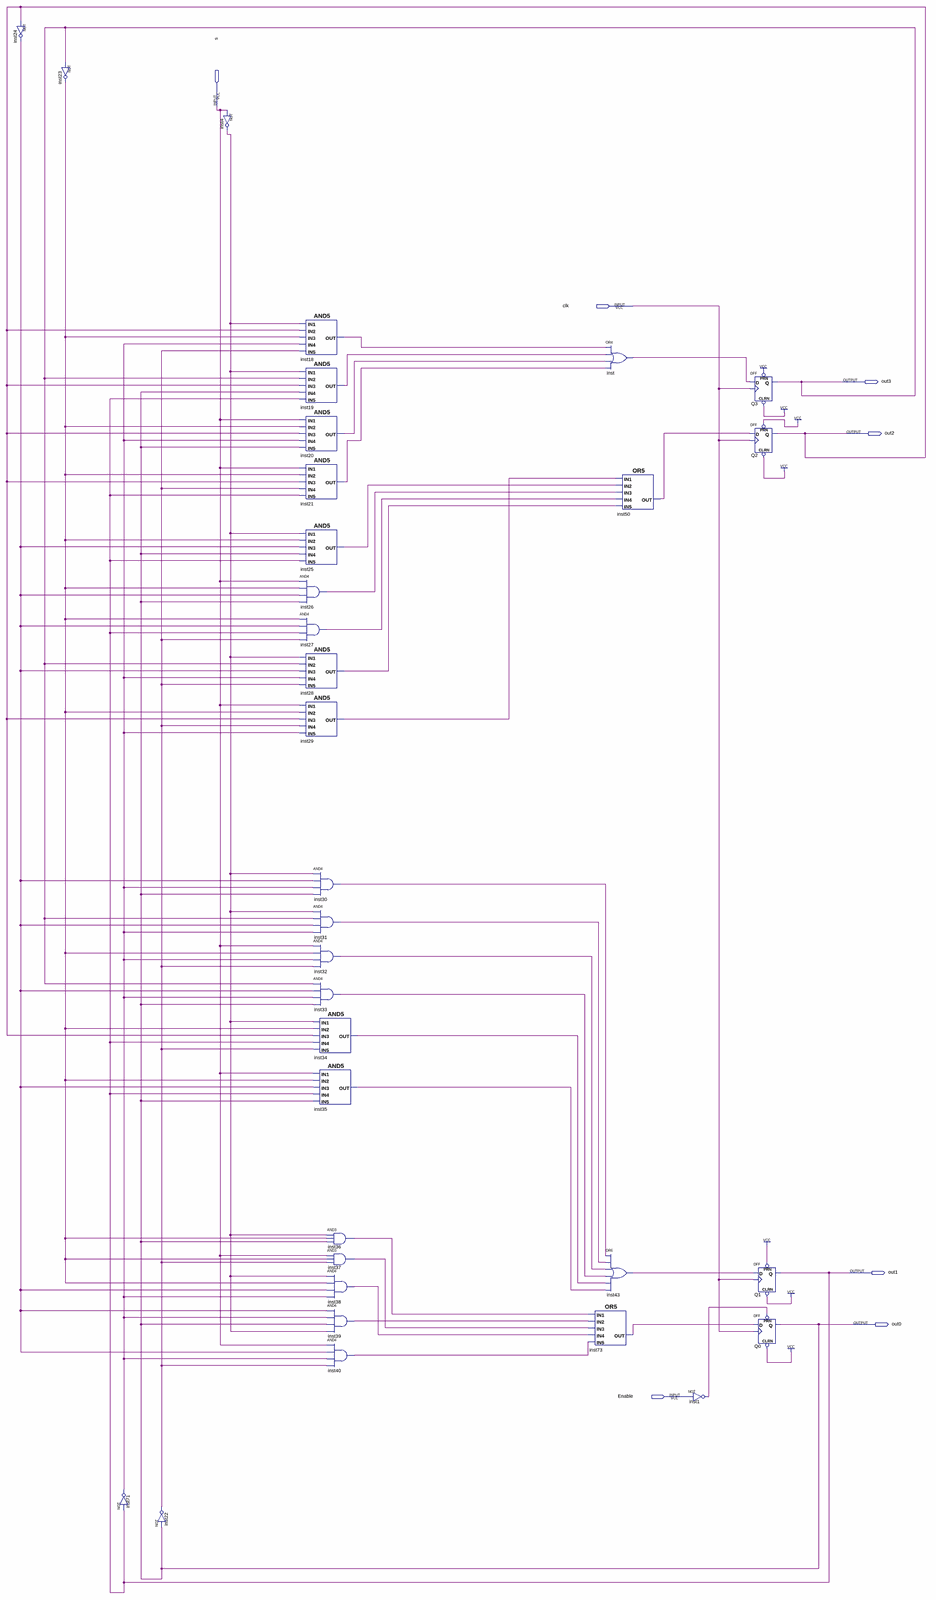
[diagram p0: schematic sheet, whole]
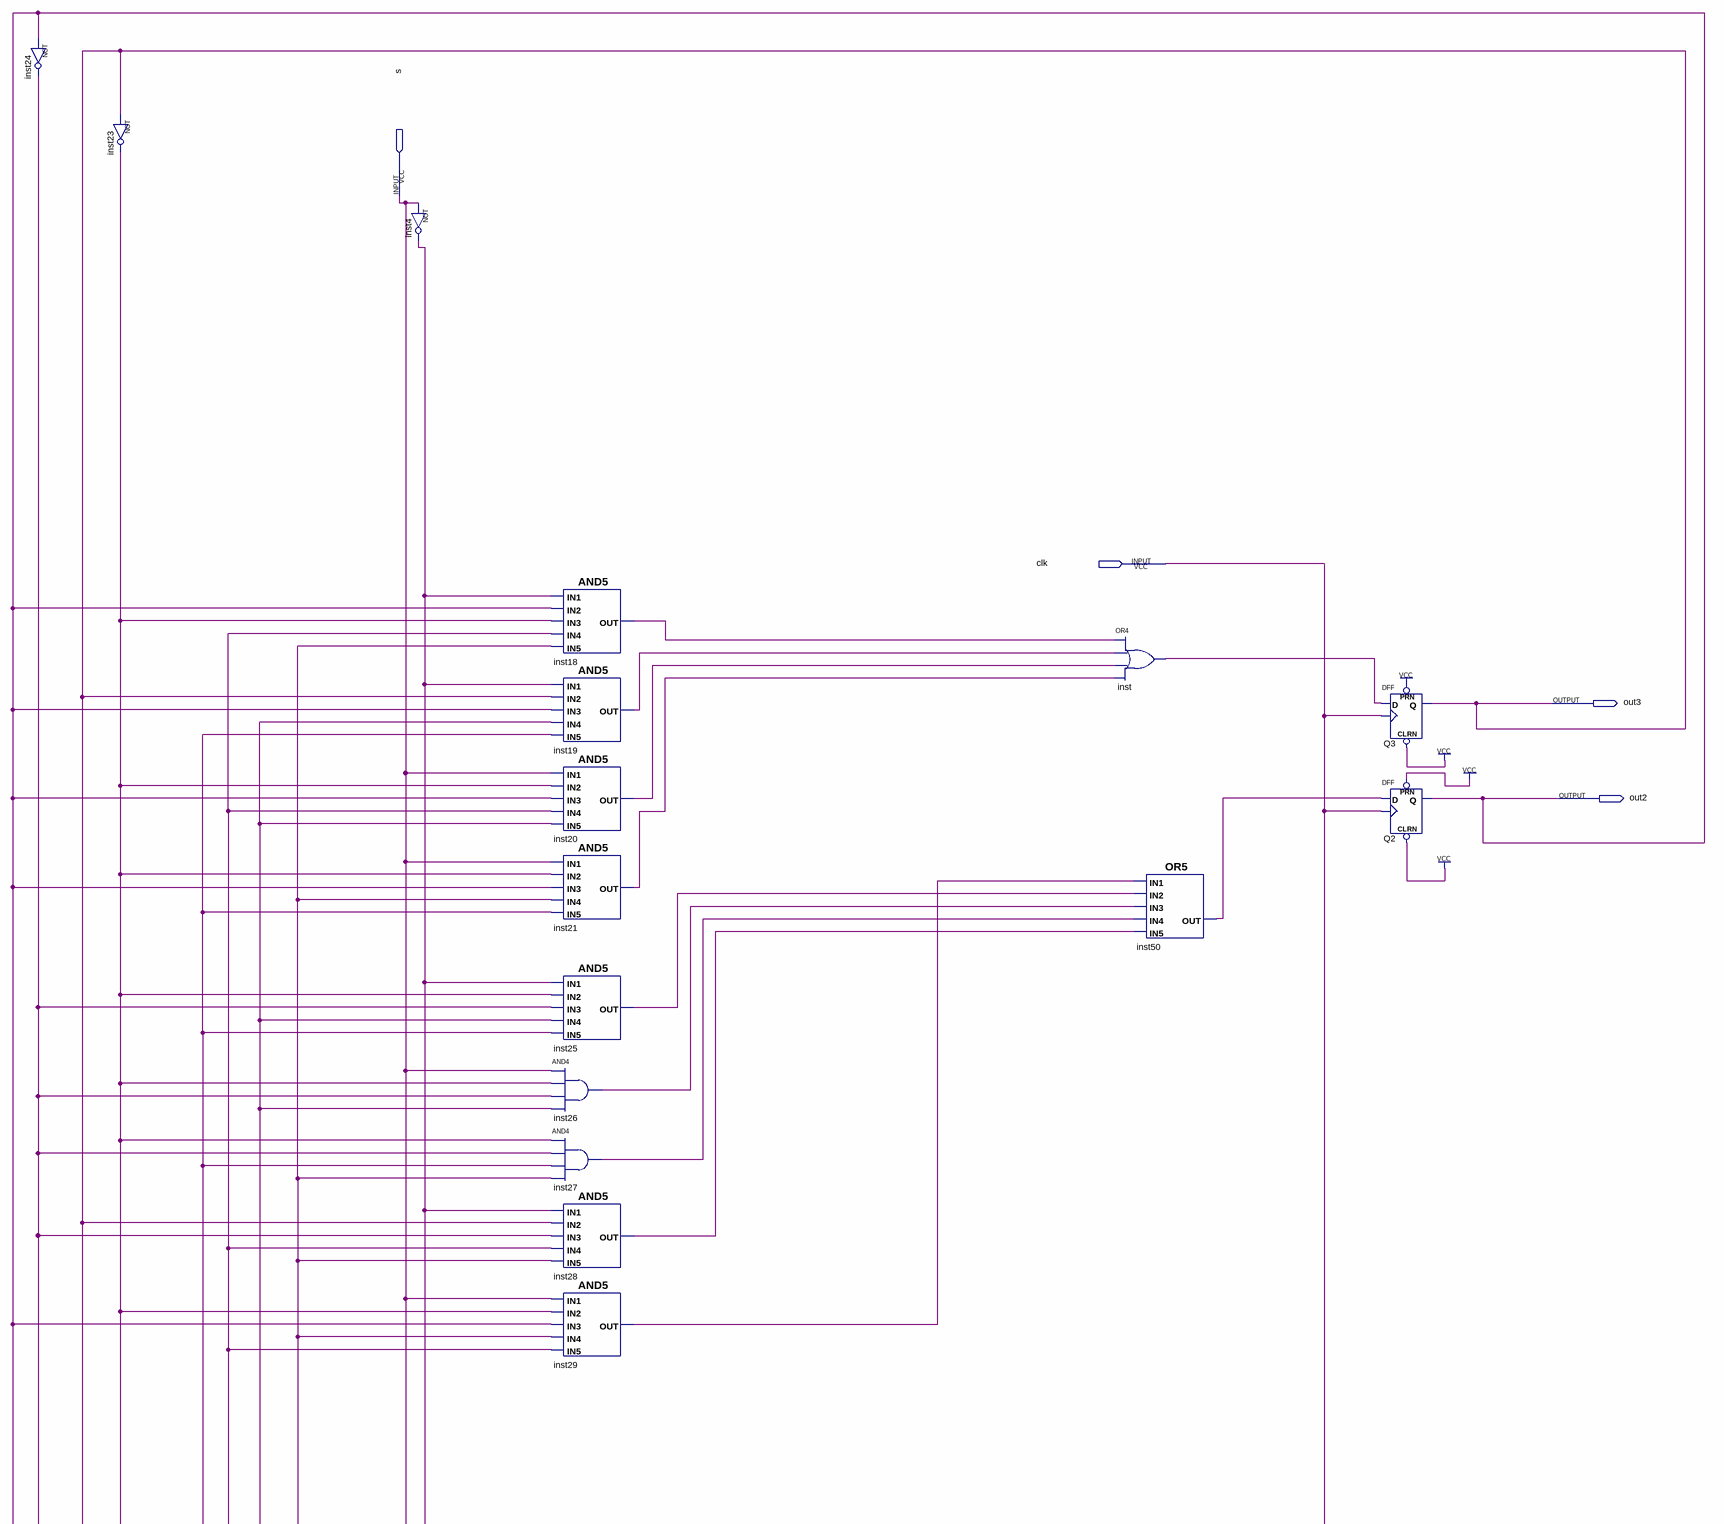
[diagram p1: schematic sheet, upper part]
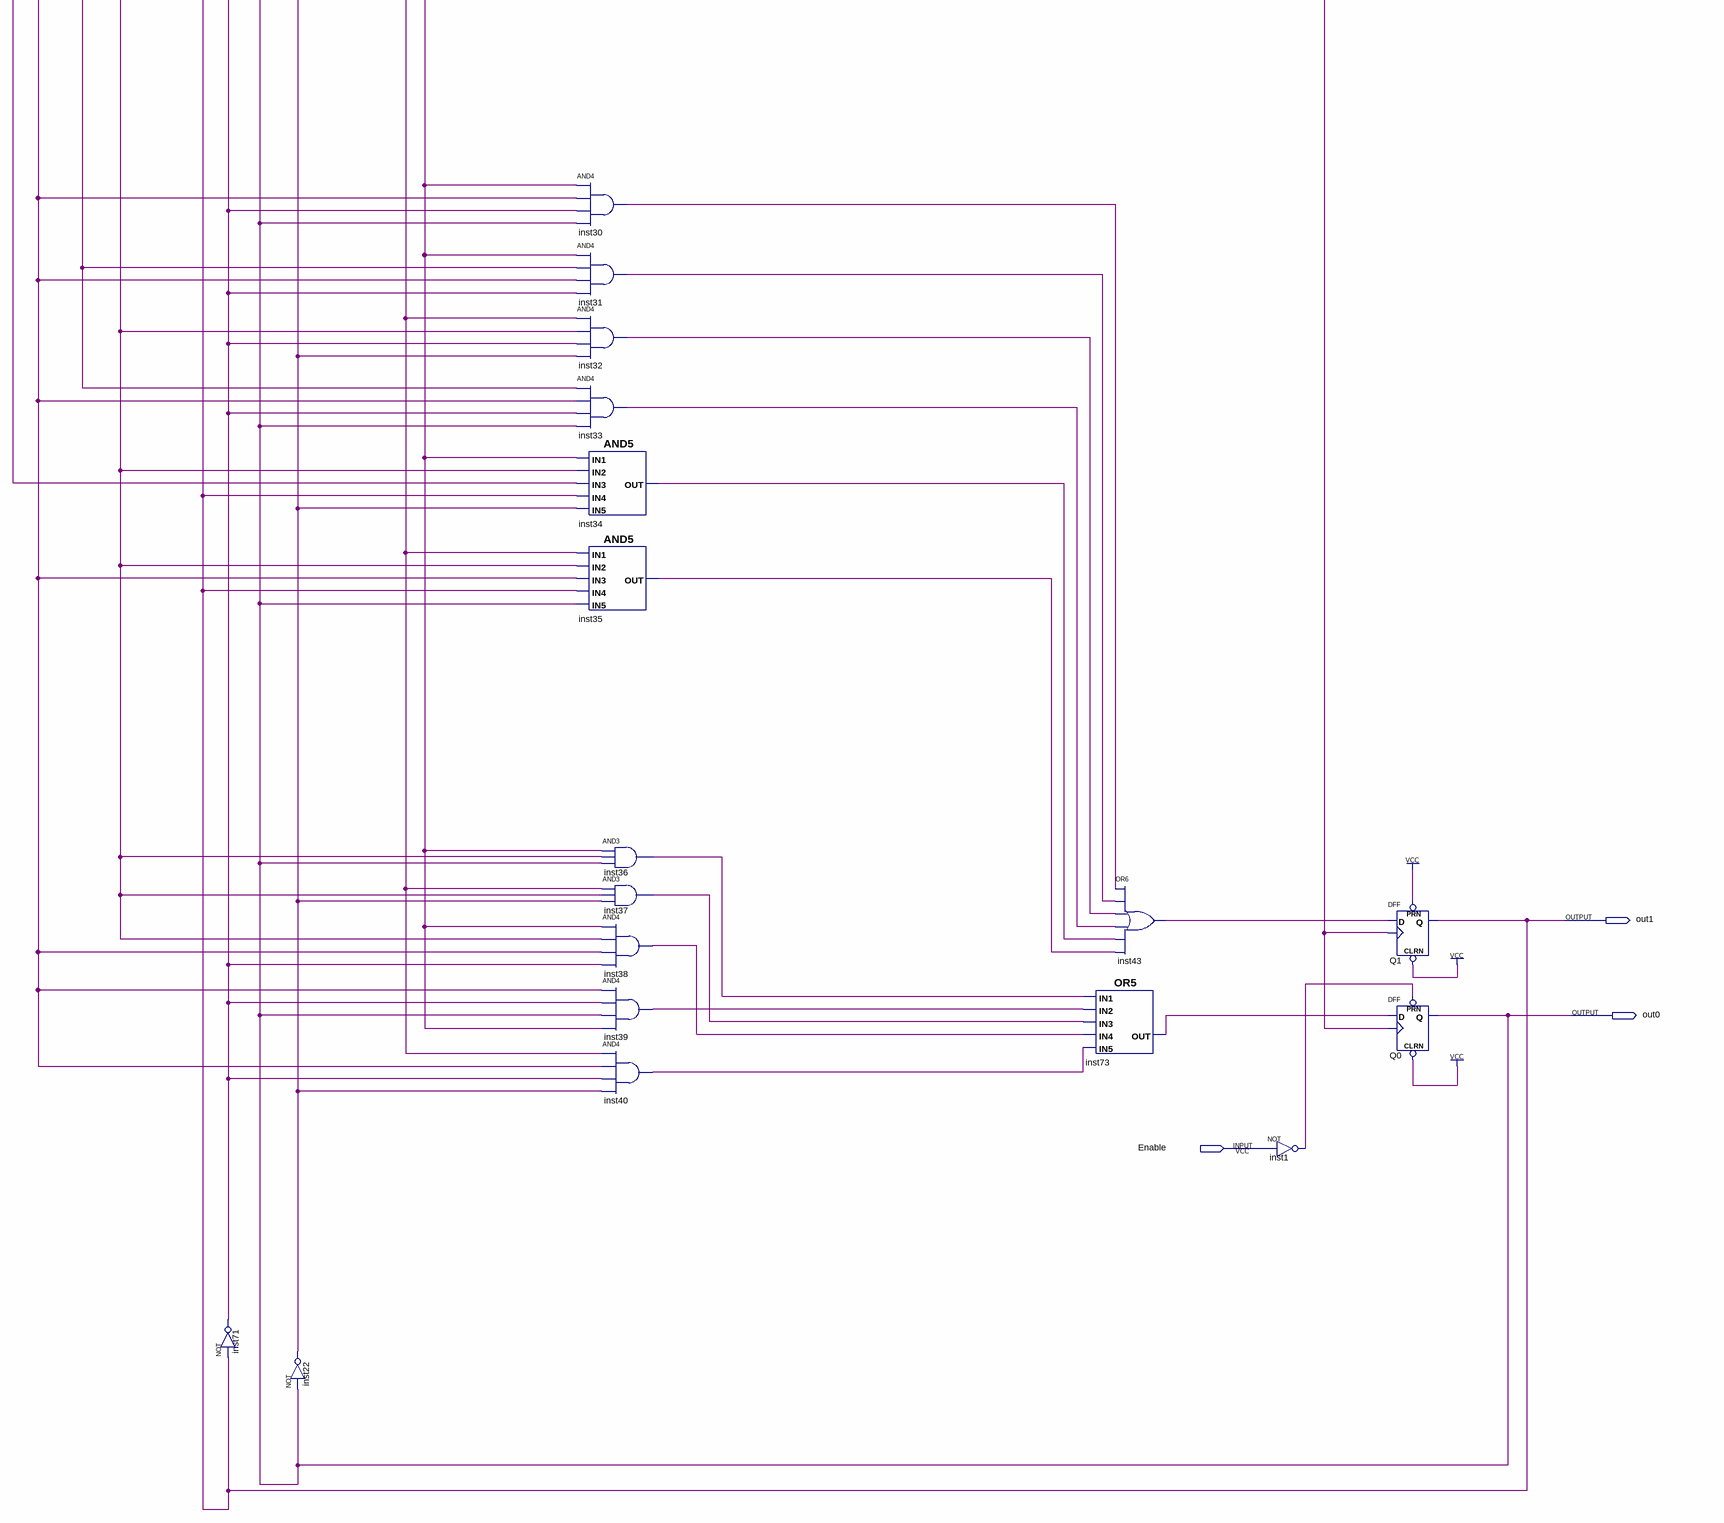
[diagram p2: schematic sheet, lower part]
// Quartus schematic Statemachine.bdf as structural Verilog: 34 symbols, 7 pins
module Statemachine (
  input  s,
  input  clk,
  input  Enable,
  output out3,
  output out2,
  output out1,
  output out0
);

  wire inst1_out, inst4_out, inst18_out, inst19_out, inst20_out, inst21_out, inst22_out, inst23_out,
       inst24_out, inst25_out, inst26_out, inst27_out, inst28_out, inst29_out, inst30_out, inst31_out,
       inst32_out, inst33_out, inst34_out, inst35_out, inst36_out, inst37_out, inst38_out, inst39_out,
       inst40_out, inst43_out, inst50_out, inst71_out, inst73_out, inst_out;

  not inst24 (inst24_out, out2);
  not inst23 (inst23_out, out3);
  not inst71 (inst71_out, out1);
  not inst22 (inst22_out, out0);
  not inst4 (inst4_out, s);
  and inst18 (inst18_out, inst4_out, out2, inst23_out, inst71_out, inst22_out);
  and inst19 (inst19_out, inst4_out, out3, out2, out0, out1);
  and inst20 (inst20_out, s, inst23_out, out2, inst71_out, out0);
  and inst21 (inst21_out, s, inst23_out, out2, inst22_out, out1);
  and inst25 (inst25_out, inst4_out, inst23_out, inst24_out, out0, out1);
  and inst26 (inst26_out, s, inst23_out, inst24_out, out0);
  and inst27 (inst27_out, inst23_out, inst24_out, out1, inst22_out);
  and inst28 (inst28_out, inst4_out, out3, inst24_out, inst71_out, inst22_out);
  and inst29 (inst29_out, s, inst23_out, out2, inst22_out, inst71_out);
  and inst30 (inst30_out, inst4_out, inst24_out, inst71_out, out0);
  and inst31 (inst31_out, inst4_out, out3, inst24_out, inst71_out);
  and inst32 (inst32_out, s, inst23_out, inst71_out, inst22_out);
  and inst33 (inst33_out, out3, inst24_out, inst71_out, out0);
  and inst34 (inst34_out, inst4_out, inst23_out, out2, out1, inst22_out);
  and inst35 (inst35_out, s, inst23_out, inst24_out, out1, out0);
  and inst36 (inst36_out, inst4_out, inst23_out, out0);
  and inst37 (inst37_out, s, inst23_out, inst22_out);
  and inst38 (inst38_out, inst4_out, inst23_out, inst24_out, inst71_out);
  and inst39 (inst39_out, inst24_out, inst71_out, out0, inst4_out);
  and inst40 (inst40_out, s, inst24_out, inst71_out, inst22_out);
  or inst73 (inst73_out, inst36_out, inst39_out, inst37_out, inst38_out, inst40_out);
  or inst (inst_out, inst18_out, inst19_out, inst20_out, inst21_out);
  or inst50 (inst50_out, inst29_out, inst25_out, inst26_out, inst27_out, inst28_out);
  or inst43 (inst43_out, inst30_out, inst31_out, inst32_out, inst33_out, inst34_out, inst35_out);
  not inst1 (inst1_out, Enable);
  DFF Q3 (.CLRN(1'b1), .CLK(clk), .D(inst_out), .PRN(1'b1), .Q(out3));
  DFF Q2 (.CLRN(1'b1), .CLK(clk), .D(inst50_out), .PRN(1'b1), .Q(out2));
  DFF Q1 (.CLRN(1'b1), .CLK(clk), .D(inst43_out), .PRN(1'b1), .Q(out1));
  DFF Q0 (.CLRN(1'b1), .CLK(clk), .D(inst73_out), .PRN(inst1_out), .Q(out0));
endmodule
